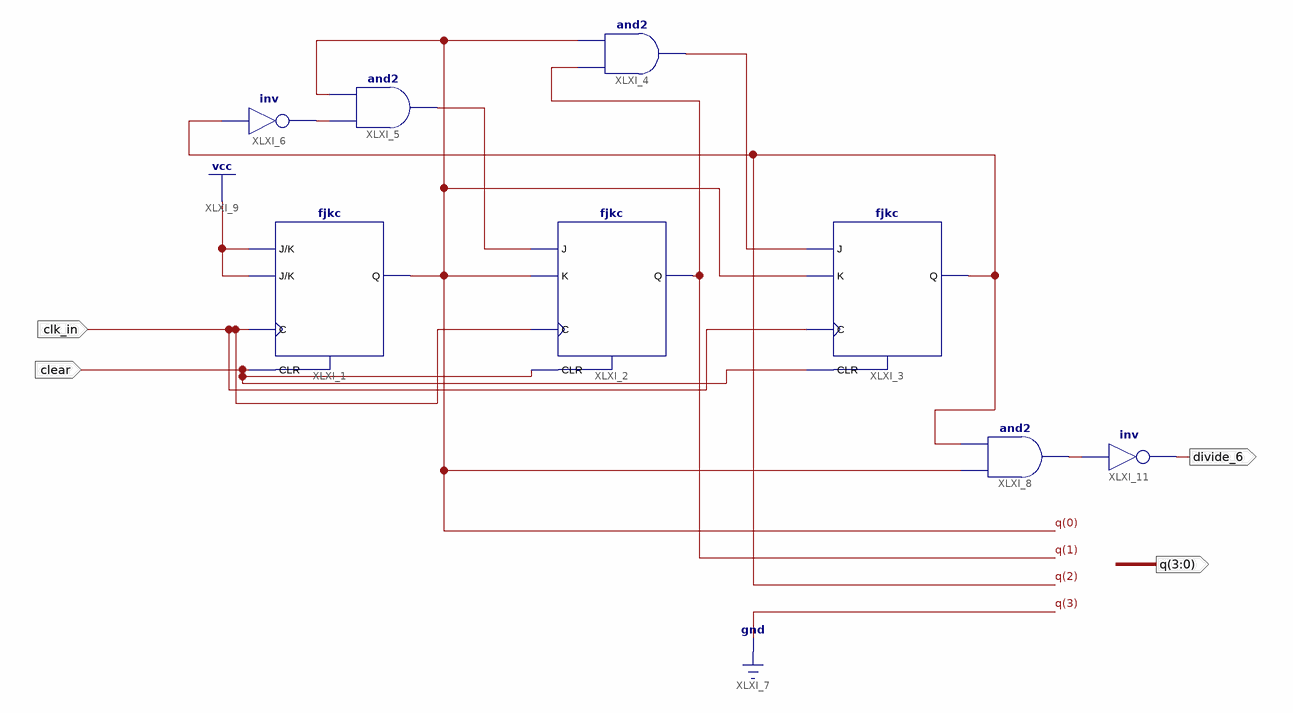
[diagram p0: schematic sheet 1]
// Xilinx ISE schematic counter05.sch (spartan6) as structural Verilog: 8 symbols, 4 ports
module counter05 (
  input  clear,
  input  clk_in,
  output [3:0] q,
  output divide_6
);

  wire XLXN_5, XLXN_6, XLXN_9, XLXN_20;

  fjkc XLXI_1 (.C(clk_in), .CLR(clear), .J(1'b1), .K(1'b1), .Q(q[0]));
  fjkc XLXI_2 (.C(clk_in), .CLR(clear), .J(XLXN_9), .K(q[0]), .Q(q[1]));
  fjkc XLXI_3 (.C(clk_in), .CLR(clear), .J(XLXN_5), .K(q[0]), .Q(q[2]));
  and XLXI_4 (XLXN_5, q[1], q[0]);
  and XLXI_5 (XLXN_9, XLXN_6, q[0]);
  not XLXI_6 (XLXN_6, q[2]);
  and XLXI_8 (XLXN_20, q[0], q[2]);
  not XLXI_11 (divide_6, XLXN_20);

  assign q[3] = 1'b0;
endmodule
